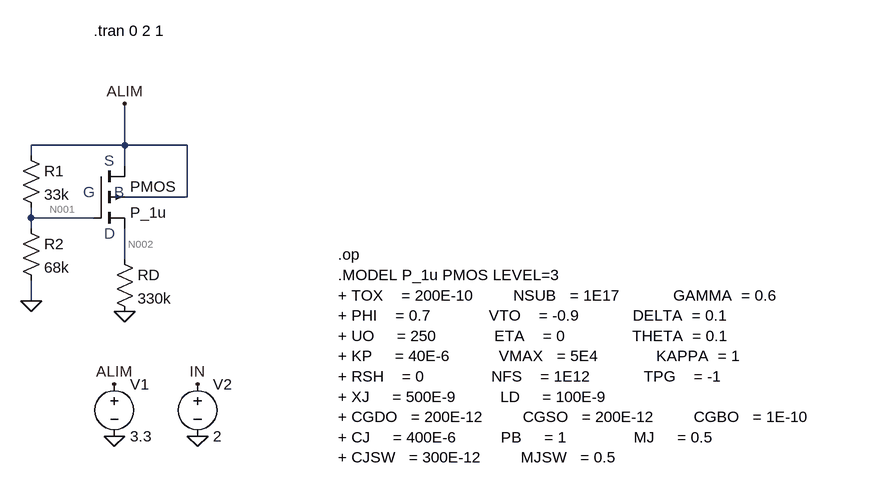
[diagram p0: schematic DiviseurRésistif.asc]
DiviseurRésistif.asc, the LTspice schematic file:
Version 4
SHEET 1 880 680
WIRE -304 48 -304 -16
WIRE -304 48 -448 48
WIRE -208 48 -304 48
WIRE -448 64 -448 48
WIRE -304 80 -304 48
WIRE -208 128 -208 48
WIRE -208 128 -304 128
WIRE -448 160 -448 144
WIRE -352 160 -448 160
WIRE -448 176 -448 160
WIRE -304 224 -304 176
WIRE -448 288 -448 256
FLAG -320 416 ALIM
FLAG -192 416 IN
FLAG -192 496 0
FLAG -320 496 0
FLAG -304 304 0
FLAG -304 -16 ALIM
FLAG -448 288 0
SYMBOL voltage -320 400 R0
WINDOW 123 0 0 Left 0
WINDOW 39 0 0 Left 0
SYMATTR InstName V1
SYMATTR Value 3.3
SYMBOL voltage -192 400 R0
WINDOW 123 0 0 Left 0
WINDOW 39 0 0 Left 0
SYMATTR InstName V2
SYMATTR Value 2
SYMBOL pmos4 -352 80 R0
SYMATTR InstName PMOS
SYMATTR Value P_1u
SYMATTR Value2 l=1u w=2.5u
SYMBOL res -320 208 R0
SYMATTR InstName RD
SYMATTR Value 330k
SYMBOL res -464 48 R0
SYMATTR InstName R1
SYMATTR Value 33k
SYMBOL res -464 160 R0
SYMATTR InstName R2
SYMATTR Value 68k
TEXT 24 216 Left 2 !.op
TEXT 24 248 Left 2 !.MODEL P_1u PMOS LEVEL=3\n+ TOX    = 200E-10         NSUB   = 1E17            GAMMA  = 0.6          \n+ PHI    = 0.7             VTO    = -0.9            DELTA  = 0.1          \n+ UO     = 250             ETA    = 0               THETA  = 0.1         \n+ KP     = 40E-6           VMAX   = 5E4             KAPPA  = 1         \n+ RSH    = 0               NFS    = 1E12            TPG    = -1                 \n+ XJ     = 500E-9          LD     = 100E-9               \n+ CGDO   = 200E-12         CGSO   = 200E-12         CGBO   = 1E-10              \n+ CJ     = 400E-6          PB     = 1               MJ     = 0.5                \n+ CJSW   = 300E-12         MJSW   = 0.5
TEXT -336 72 Left 2 ;S
TEXT -352 -128 Left 2 !.tran 0 2 1
TEXT -368 120 Left 2 ;G
TEXT -320 120 Left 2 ;B
TEXT -336 184 Left 2 ;D

The netlist it stands for:
* DiviseurRésistif.asc
V1 ALIM 0 3.3
V2 IN 0 2
M§PMOS ALIM N001 N002 ALIM P_1u l=1u w=2.5u
RD N002 0 330k
R1 ALIM N001 33k
R2 N001 0 68k
.model NMOS NMOS
.model PMOS PMOS
.lib standard.mos
.op
.MODEL P_1u PMOS LEVEL=3
+ TOX    = 200E-10         NSUB   = 1E17            GAMMA  = 0.6
+ PHI    = 0.7             VTO    = -0.9            DELTA  = 0.1
+ UO     = 250             ETA    = 0               THETA  = 0.1
+ KP     = 40E-6           VMAX   = 5E4             KAPPA  = 1
+ RSH    = 0               NFS    = 1E12            TPG    = -1
+ XJ     = 500E-9          LD     = 100E-9
+ CGDO   = 200E-12         CGSO   = 200E-12         CGBO   = 1E-10
+ CJ     = 400E-6          PB     = 1               MJ     = 0.5
+ CJSW   = 300E-12         MJSW   = 0.5
* S
.tran 0 2 1
* G
* B
* D
.backanno
.end

* Results of the author's LTspice run, read from the files saved beside the schematic
* Operating Point, zero values left out:
*   V(alim) = 3.3 V
*   V(in) = 2 V
*   V(n001) = 2.222 V
*   V(n002) = 1.004 V
*   Id(Pmos) = 3.042 µA
*   Ib(Pmos) = 2.306 pA
*   Is(Pmos) = -3.042 µA
*   I(R2) = 32.67 µA
*   I(R1) = 32.67 µA
*   I(Rd) = 3.042 µA
*   I(V1) = -35.72 µA